# EAGLE design HMC5883Shield (EAGLE 7.4.0)
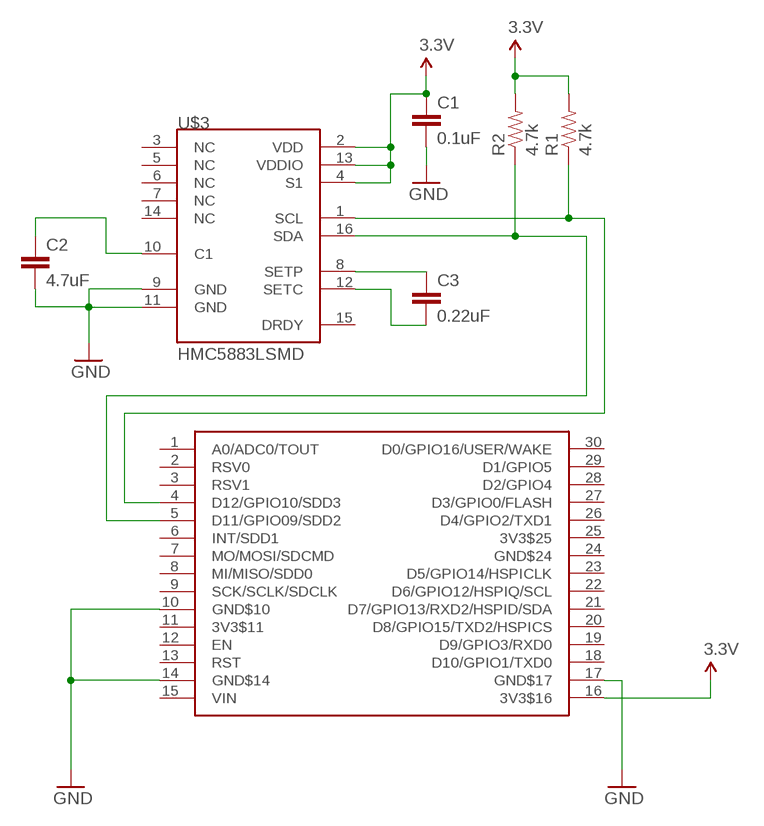
[diagram p0: schematic, sheet 1]

## Parts
C1  0.1uF  CAP0402-CAP  [0402-CAP]
C2  4.7uF  CAP0402-CAP  [0402-CAP]
C3  0.22uF  CAP0402-CAP  [0402-CAP]
R1  4.7k  RESISTOR0402-RES  [0402-RES]
R2  4.7k  RESISTOR0402-RES  [0402-RES]
U$1  NERDSHIELD  [NERDUINO_STACK]
U$3  HMC5883LSMD  [16LPCC]

## Nets
3.3V: C1.1 R1.2 R2.2 U$1.16(3V3$16) U$3.2(VDD) U$3.4(S1) U$3.13(VDDIO)
GND: C1.2 C2.2 U$1.10(GND$10) U$1.14(GND$14) U$1.17(GND$17) U$3.9(GND) U$3.11(GND)
N$1: C2.1 U$3.10(C1)
N$2: R2.1 U$1.5(D11/GPIO09/SDD2) U$3.16(SDA)
N$3: R1.1 U$1.4(D12/GPIO10/SDD3) U$3.1(SCL)
N$5: C3.1 U$3.8(SETP)
N$6: C3.2 U$3.12(SETC)
Unconnected: U$1.1(A0/ADC0/TOUT) U$1.2(RSV0) U$1.3(RSV1) U$1.6(INT/SDD1) U$1.7(MO/MOSI/SDCMD) U$1.8(MI/MISO/SDD0) U$1.9(SCK/SCLK/SDCLK) U$1.11(3V3$11) U$1.12(EN) U$1.13(RST) U$1.15(VIN) U$1.18(D10/GPIO1/TXD0) U$1.19(D9/GPIO3/RXD0) U$1.20(D8/GPIO15/TXD2/HSPICS) U$1.21(D7/GPIO13/RXD2/HSPID/SDA) U$1.22(D6/GPIO12/HSPIQ/SCL) U$1.23(D5/GPIO14/HSPICLK) U$1.24(GND$24) U$1.25(3V3$25) U$1.26(D4/GPIO2/TXD1) U$1.27(D3/GPIO0/FLASH) U$1.28(D2/GPIO4) U$1.29(D1/GPIO5) U$1.30(D0/GPIO16/USER/WAKE) U$3.3(NC) U$3.5(NC) U$3.6(NC) U$3.7(NC) U$3.14(NC) U$3.15(DRDY)

## Library data of the parts
C1-C3 = SparkFun:CAP: Capacitor Standard 0603 ceramic capacitor, and 0.1" leaded capacitor.
R1 R2 = SparkFun:RESISTOR: Resistor Basic schematic elements and footprints for 0603, 1206, and PTH resistors.
U$1 = NerduinoShieldLib:NERDSHIELD
U$3 = SparkFun:HMC5883L: 3 Axis Digital Compass IC

## Board
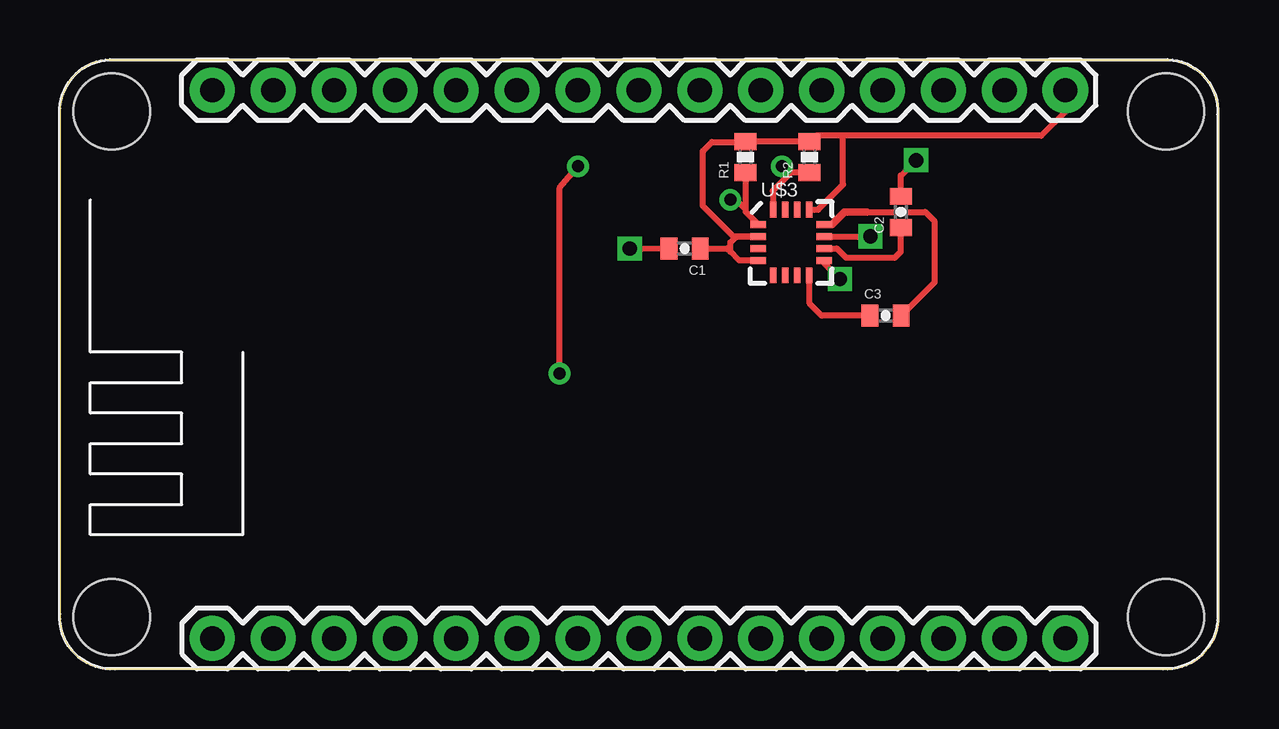
[diagram p1: board, top side]
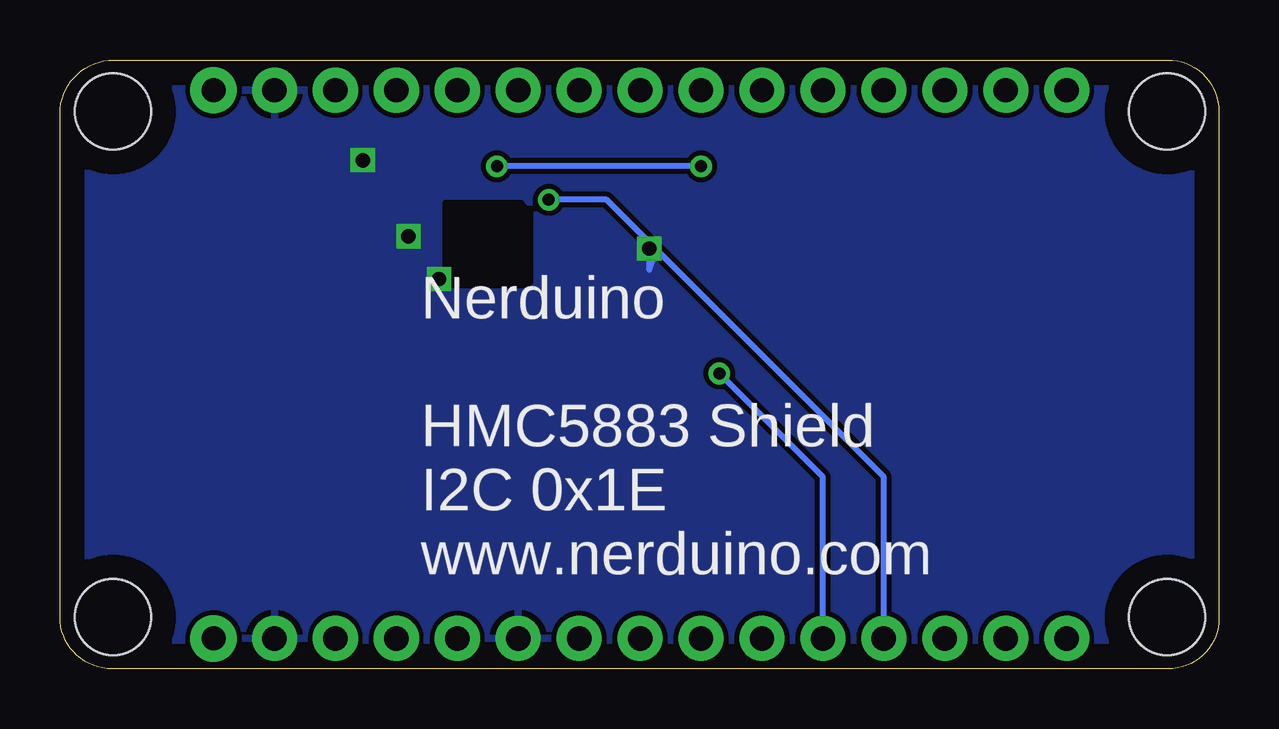
[diagram p2: board, bottom side, seen from below]

Size 48.31 x 25.39 mm. Coordinates in mm from the lower left corner, seen from the top.
Outline: 0.01,23.25 0,2.12 arc90 2.11,0 46.15,0 arc90 48.31,2.16 48.31,23.15 arc90 46.07,25.39 2.14,25.39 arc90 0.01,23.25
Copper layers (1*16): Top 0.035mm / dielectric 1.5mm / Bottom 0.035mm
Design rules "default": minimum track width 10mil, minimum drill 24mil, track to track 8mil, track to pad 8mil, pad to pad 8mil, via to via 8mil, smd to smd 8mil, copper to edge 40mil, drill to drill 8mil, minimum pad ring 10mil, minimum via ring 8mil, stop-mask expansion 4mil, vias tented up to drill 0mil, thermal gap 10mil

### Footprints (pad centres in the part's own frame; a part is rotated, then mirrored left to right if it is on the bottom)
0402-CAP = smd 0.7 x 0.9: 1 -0.65,0; 2 0.65,0
0402-RES = smd 0.7 x 0.9: 1 -0.65,0; 2 0.65,0
NERDUINO_STACK = drill 1.016 pad 1.88: 1 -17.78,-5.08; 2 -15.24,-5.08; 3 -12.7,-5.08; 4 -10.16,-5.08; 5 -7.62,-5.08; 6 -5.08,-5.08; 7 -2.54,-5.08; 8 0,-5.08; 9 2.54,-5.08; 10 5.08,-5.08; 11 7.62,-5.08; 12 10.16,-5.08; 13 12.7,-5.08; 14 15.24,-5.08; 17 15.24,17.78; 18 12.7,17.78; 19 10.16,17.78; 20 7.62,17.78; 21 5.08,17.78; 22 2.54,17.78; 23 0,17.78; 24 -2.54,17.78; 25 -5.08,17.78; 26 -7.62,17.78; 27 -10.16,17.78; 28 -12.7,17.78; 29 -15.24,17.78; 30 -17.78,17.78 | drill 1 pad 1.93: 15 17.78,-5.08; 16 17.78,17.78 | hole 3.175: -21.971,16.891; -21.971,-4.191; 21.971,-4.191; 21.971,16.891
16LPCC = smd 0.65 x 0.28: 1 -1.37,0.75; 2 -1.37,0.25; 3 -1.37,-0.25; 4 -1.37,-0.75; 9 1.37,-0.75; 10 1.37,-0.25; 11 1.37,0.25; 12 1.37,0.75 | smd 0.28 x 0.65: 5 -0.75,-1.37; 6 -0.25,-1.37; 7 0.25,-1.37; 8 0.75,-1.37; 13 0.75,1.37; 14 0.25,1.37; 15 -0.25,1.37; 16 -0.75,1.37

### Placement (x,y rotation side)
C1  26.03,17.53 180 top
C2  35.05,19.05 90 top
C3  34.42,14.73 0 top
R1  28.57,21.34 90 top
R2  31.24,21.34 90 top
U$1  24.13,6.35 0 top
U$3  30.48,17.78 0 top

### Tracks (layer width: path | path; a pad name or v marks a point on that pad's centre or on a via)
3.3V
  Top 0.254: 29.08,17 U$3.4 28.31,17.03 27.94,17.4 | U$1.16 41.91,23.24 40.89,22.23 32.64,22.23 | 32.64,22.23 31.48,22.23 R2.2 R1.2 28.56,21.97 27.18,21.97 26.8,21.59 26.8,19.3 28.07,18.03 U$3.2 28.19,18.03 27.94,17.78 27.94,17.4 | U$3.13 31.6,19.15 32.64,20.19 32.64,22.23 | C1.1 27.81,17.53 27.94,17.4
GND  (via drill 0.6)
  Top 0.254: U$3.11 33.65,18.03 v33.78,18.03 | C1.2 24.27,17.51 v23.75,17.53 | U$3.9 31.85,16.92 v32.51,16.26 | C2.2 35.05,20.57 v35.69,21.21
  Bottom 0.254: v33.78,18.03 33.65,18.16 | v23.75,17.53 23.75,16.64 23.62,17.02 | v32.51,16.26 32.89,16.26 | v35.69,21.21 35.94,21.21
  pour Bottom: 0,25.15 48.26,25.27 48.26,0.13 0,0
N$1
  Top 0.254: U$3.10 32.38,17.53 32.77,17.14 34.8,17.14 35.05,17.4 C2.1
N$2  (via drill 0.5)
  Top 0.254: R2.1 31.24,20.7 30.48,20.7 | 30.48,20.7 29.72,19.94 29.72,19.16 U$3.16 | v20.83,12.32 20.83,20.07 v21.59,20.95 | v30.1,20.95 30.35,20.83 30.48,20.7
  Bottom 0.254: U$1.5 16.51,8 v20.83,12.32 | v21.59,20.95 v30.1,20.95
N$3  (via drill 0.5)
  Top 0.254: R1.1 28.57,19.18 | 28.57,19.18 28.57,19.07 U$3.1 | v27.94,19.56 28.19,19.56 28.57,19.18
  Bottom 0.254: U$1.4 13.97,8 25.53,19.56 v27.94,19.56
N$4
  cutout Bottom: 29.08,19.43 32.26,19.43 32.26,16 28.83,16 28.83,16.13 28.7,16.13 28.7,19.05
N$5
  Top 0.254: C3.1 31.75,14.73 31.24,15.24 31.24,16.4 U$3.8
N$6
  Top 0.254: 33.64,19.05 36.07,19.05 36.45,18.67 36.45,16.11 C3.2
  Top 0.305: U$3.12 32.18,18.53 32.7,19.05 33.64,19.05

### Text on the board
_bsilk: Nerduino / / HMC5883 Shield / I2C 0x1E / www.nerduino.com